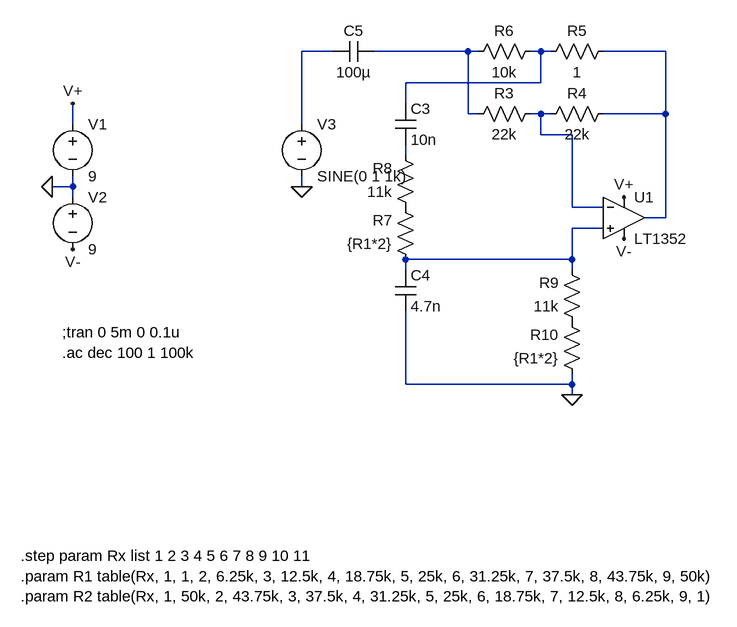
[diagram p0: schematic MID_POT.asc]
MID_POT.asc, the LTspice schematic file:
Version 4
SHEET 1 1180 912
WIRE 480 64 432 64
WIRE 688 64 544 64
WIRE 704 64 688 64
WIRE 800 64 784 64
WIRE 816 64 800 64
WIRE 992 64 896 64
WIRE 800 112 800 64
WIRE 800 112 592 112
WIRE 592 144 592 112
WIRE 688 160 688 64
WIRE 704 160 688 160
WIRE 800 160 784 160
WIRE 816 160 800 160
WIRE 992 160 992 64
WIRE 992 160 896 160
WIRE 80 176 80 144
WIRE 432 176 432 64
WIRE 800 192 800 160
WIRE 848 192 800 192
WIRE 592 224 592 208
WIRE 80 272 80 256
WIRE 80 272 48 272
WIRE 432 272 432 256
WIRE 80 288 80 272
WIRE 848 304 848 192
WIRE 896 304 848 304
WIRE 992 320 992 160
WIRE 992 320 960 320
WIRE 896 336 848 336
WIRE 848 384 848 336
WIRE 848 384 592 384
WIRE 592 400 592 384
WIRE 848 400 848 384
WIRE 592 576 592 464
WIRE 848 576 848 560
WIRE 848 576 592 576
WIRE 848 592 848 576
FLAG 80 144 V+
FLAG 928 288 V+
FLAG 432 272 0
FLAG 848 592 0
FLAG 80 368 V-
FLAG 48 272 0
FLAG 928 352 V-
SYMBOL voltage 80 160 R0
SYMATTR InstName V1
SYMATTR Value 9
SYMBOL voltage 432 160 R0
SYMATTR InstName V3
SYMATTR Value SINE(0 1 1k)
SYMATTR Value2 AC 1
SYMBOL res 800 144 R90
WINDOW 0 0 56 VBottom 2
WINDOW 3 32 56 VTop 2
SYMATTR InstName R3
SYMATTR Value 22k
SYMBOL res 912 144 R90
WINDOW 0 0 56 VBottom 2
WINDOW 3 32 56 VTop 2
SYMATTR InstName R4
SYMATTR Value 22k
SYMBOL res 912 48 R90
WINDOW 0 0 56 VBottom 2
WINDOW 3 32 56 VTop 2
SYMATTR InstName R5
SYMATTR Value 1
SYMBOL res 800 48 R90
WINDOW 0 0 56 VBottom 2
WINDOW 3 32 56 VTop 2
SYMATTR InstName R6
SYMATTR Value 10k
SYMBOL Opamps/LT1352 928 256 R0
SYMATTR InstName U1
SYMBOL cap 576 144 R0
SYMATTR InstName C3
SYMATTR Value 10n
SYMBOL res 608 320 R180
WINDOW 0 36 76 Left 2
WINDOW 3 36 40 Left 2
SYMATTR InstName R8
SYMATTR Value 11k
SYMBOL res 864 496 R180
WINDOW 0 36 76 Left 2
WINDOW 3 36 40 Left 2
SYMATTR InstName R9
SYMATTR Value 11k
SYMBOL res 864 576 R180
WINDOW 0 36 76 Left 2
WINDOW 3 36 40 Left 2
SYMATTR InstName R10
SYMATTR Value {R1*2}
SYMBOL cap 576 400 R0
SYMATTR InstName C4
SYMATTR Value 4.7n
SYMBOL cap 544 48 R90
WINDOW 0 0 32 VBottom 2
WINDOW 3 32 32 VTop 2
SYMATTR InstName C5
SYMATTR Value 100µ
SYMBOL res 608 400 R180
WINDOW 0 36 76 Left 2
WINDOW 3 36 40 Left 2
SYMATTR InstName R7
SYMATTR Value {R1*2}
SYMBOL voltage 80 272 R0
SYMATTR InstName V2
SYMATTR Value 9
TEXT 0 840 Left 2 !.step param Rx list 1 2 3 4 5 6 7 8 9 10 11\n.param R1 table(Rx, 1, 1, 2, 6.25k, 3, 12.5k, 4, 18.75k, 5, 25k, 6, 31.25k, 7, 37.5k, 8, 43.75k, 9, 50k)\n.param R2 table(Rx, 1, 50k, 2, 43.75k, 3, 37.5k, 4, 31.25k, 5, 25k, 6, 18.75k, 7, 12.5k, 8, 6.25k, 9, 1)
TEXT 64 496 Left 2 !;tran 0 5m 0 0.1u\n.ac dec 100 1 100k

The netlist it stands for:
* MID_POT.asc
V1 V+ 0 9
V3 N001 0 SINE(0 1 1k) AC 1
R3 N005 N002 22k
R4 N004 N005 22k
R5 N004 N003 1
R6 N003 N002 10k
XU1 N007 N005 V+ V- N004 LT1352  ; pins In+ In- V+ V- OUT
C3 N003 N006 10n
R8 P001 N006 11k
R9 P002 N007 11k
R10 0 P002 {R1*2}
C4 N007 0 4.7n
C5 N002 N001 100µ
R7 N007 P001 {R1*2}
V2 0 V- 9
.step param Rx list 1 2 3 4 5 6 7 8 9 10 11
.param R1 table(Rx, 1, 1, 2, 6.25k, 3, 12.5k, 4, 18.75k, 5, 25k, 6, 31.25k, 7, 37.5k, 8, 43.75k, 9, 50k)
.param R2 table(Rx, 1, 50k, 2, 43.75k, 3, 37.5k, 4, 31.25k, 5, 25k, 6, 18.75k, 7, 12.5k, 8, 6.25k, 9, 1)
;tran 0 5m 0 0.1u
.ac dec 100 1 100k
.lib LTC.lib
.backanno
.end